# Altium schematic sheet FM375_TEST_BOARD.SchDoc
size A0; PageSetup: Record=PageOptions|CenterHorizontal=True|CenterVertical=True|PrintScale=0.17|XCorrection=1.00|YCorrection=1.00|PrintKind=1|BorderSize=5000000|LeftOffset=0|BottomOffset=0|Orientation=1|PaperLength=1000|PaperWidth=1000|Scale=100|PaperSource=15|PrintQuality=600|MediaType=1|DitherType=10|PaperKind=A4|PrintScaleMode=1
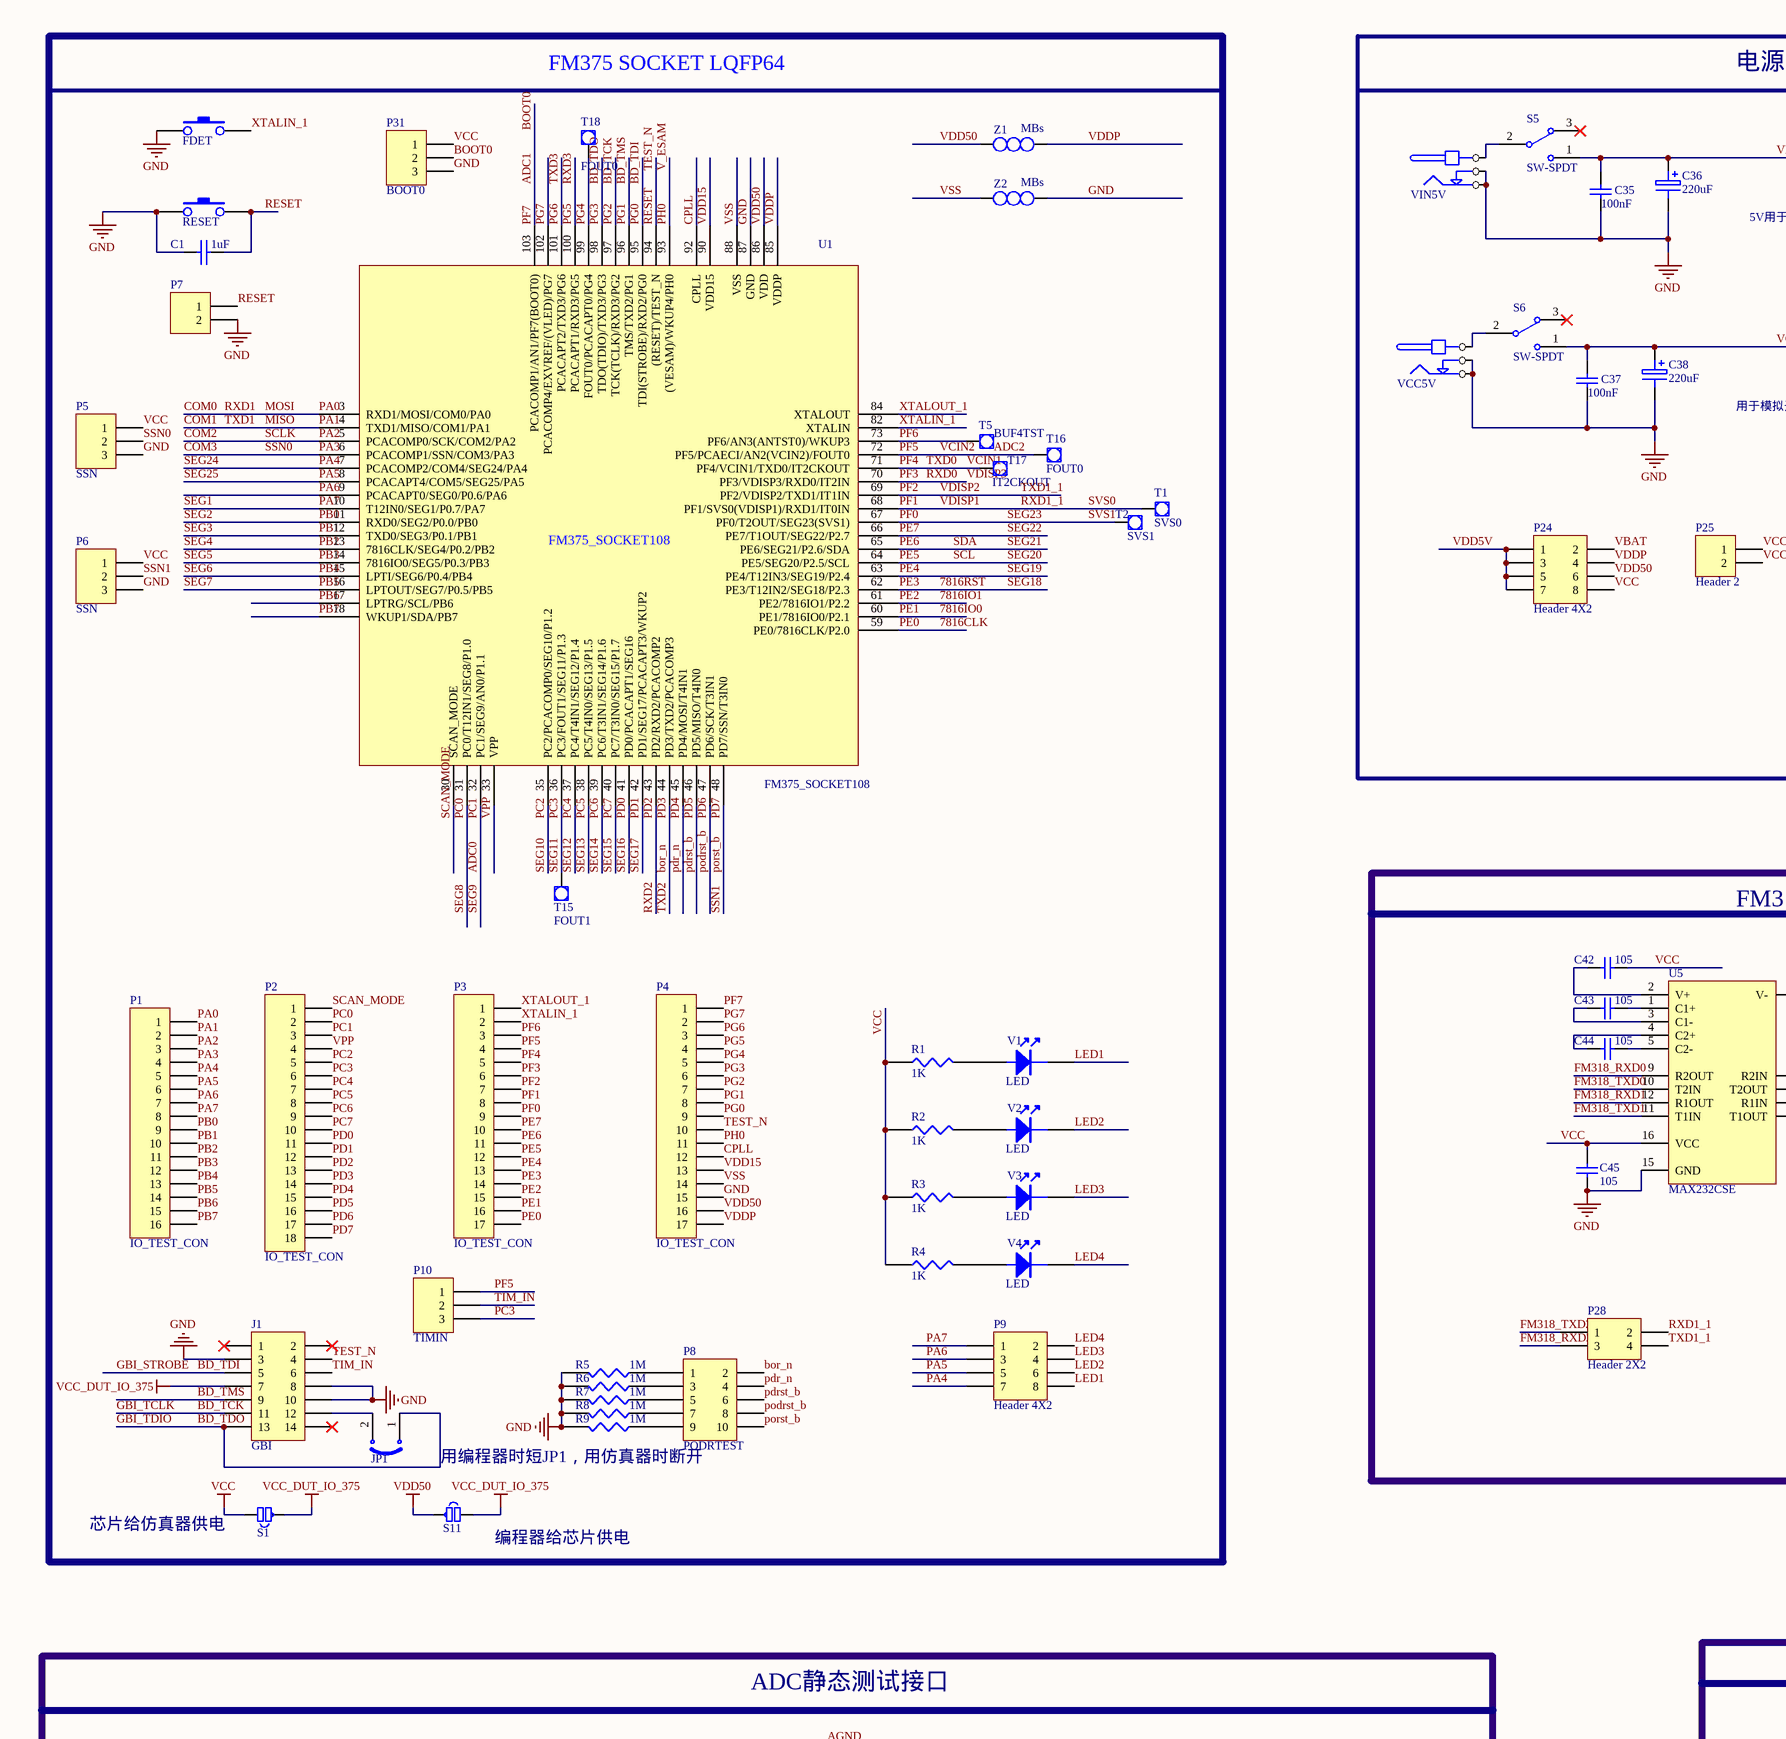
[diagram p0: FM375_TEST_BOARD.SchDoc, top left]
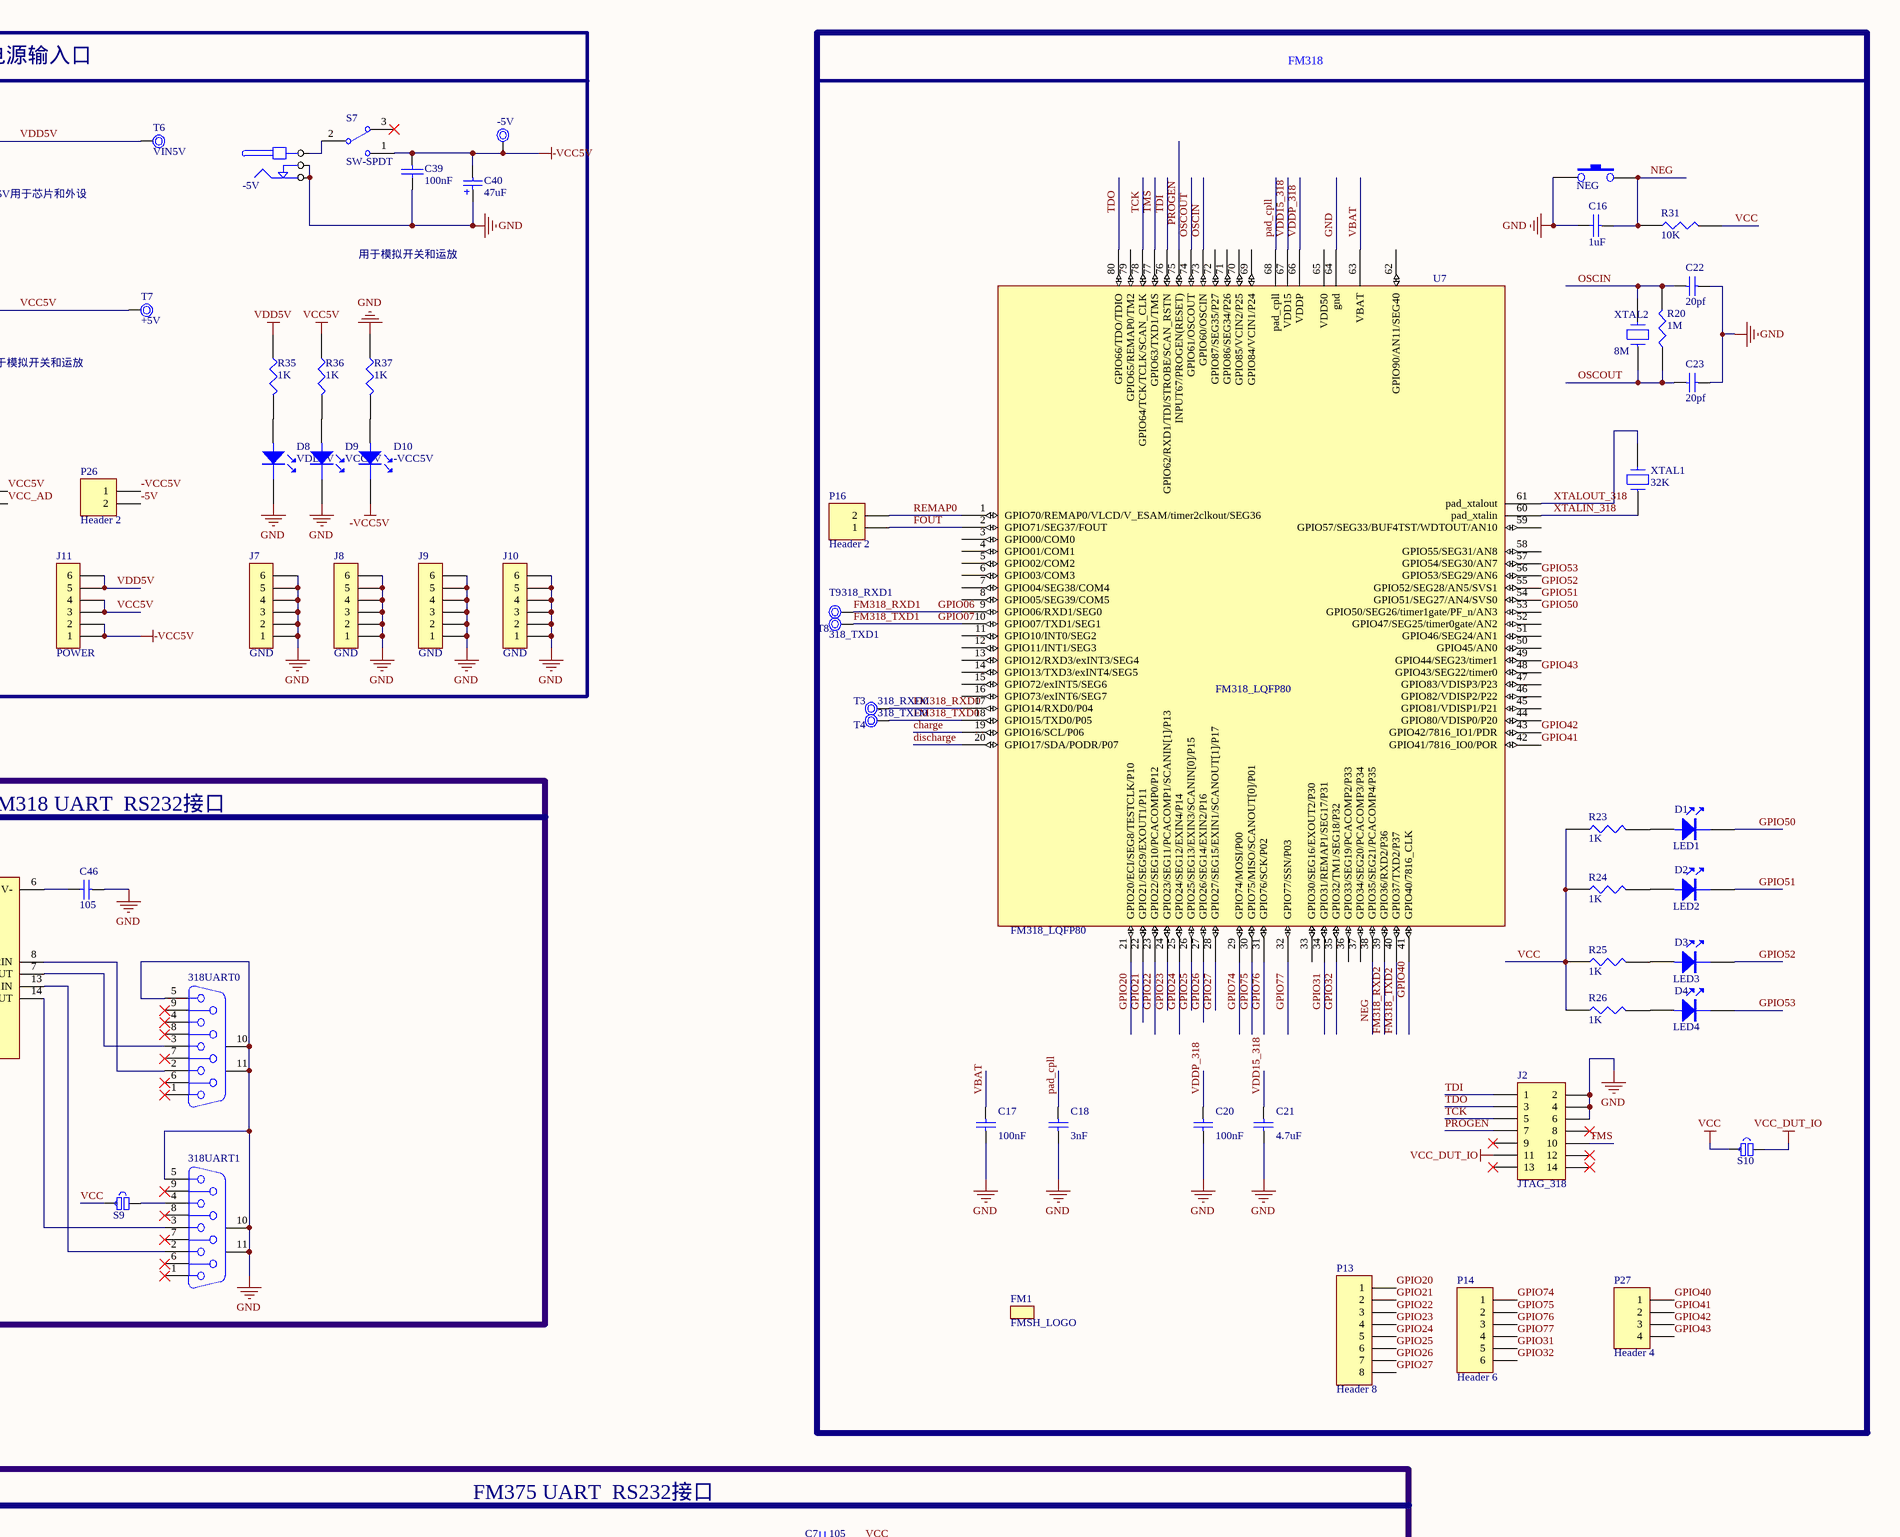
[diagram p1: FM375_TEST_BOARD.SchDoc, top right]
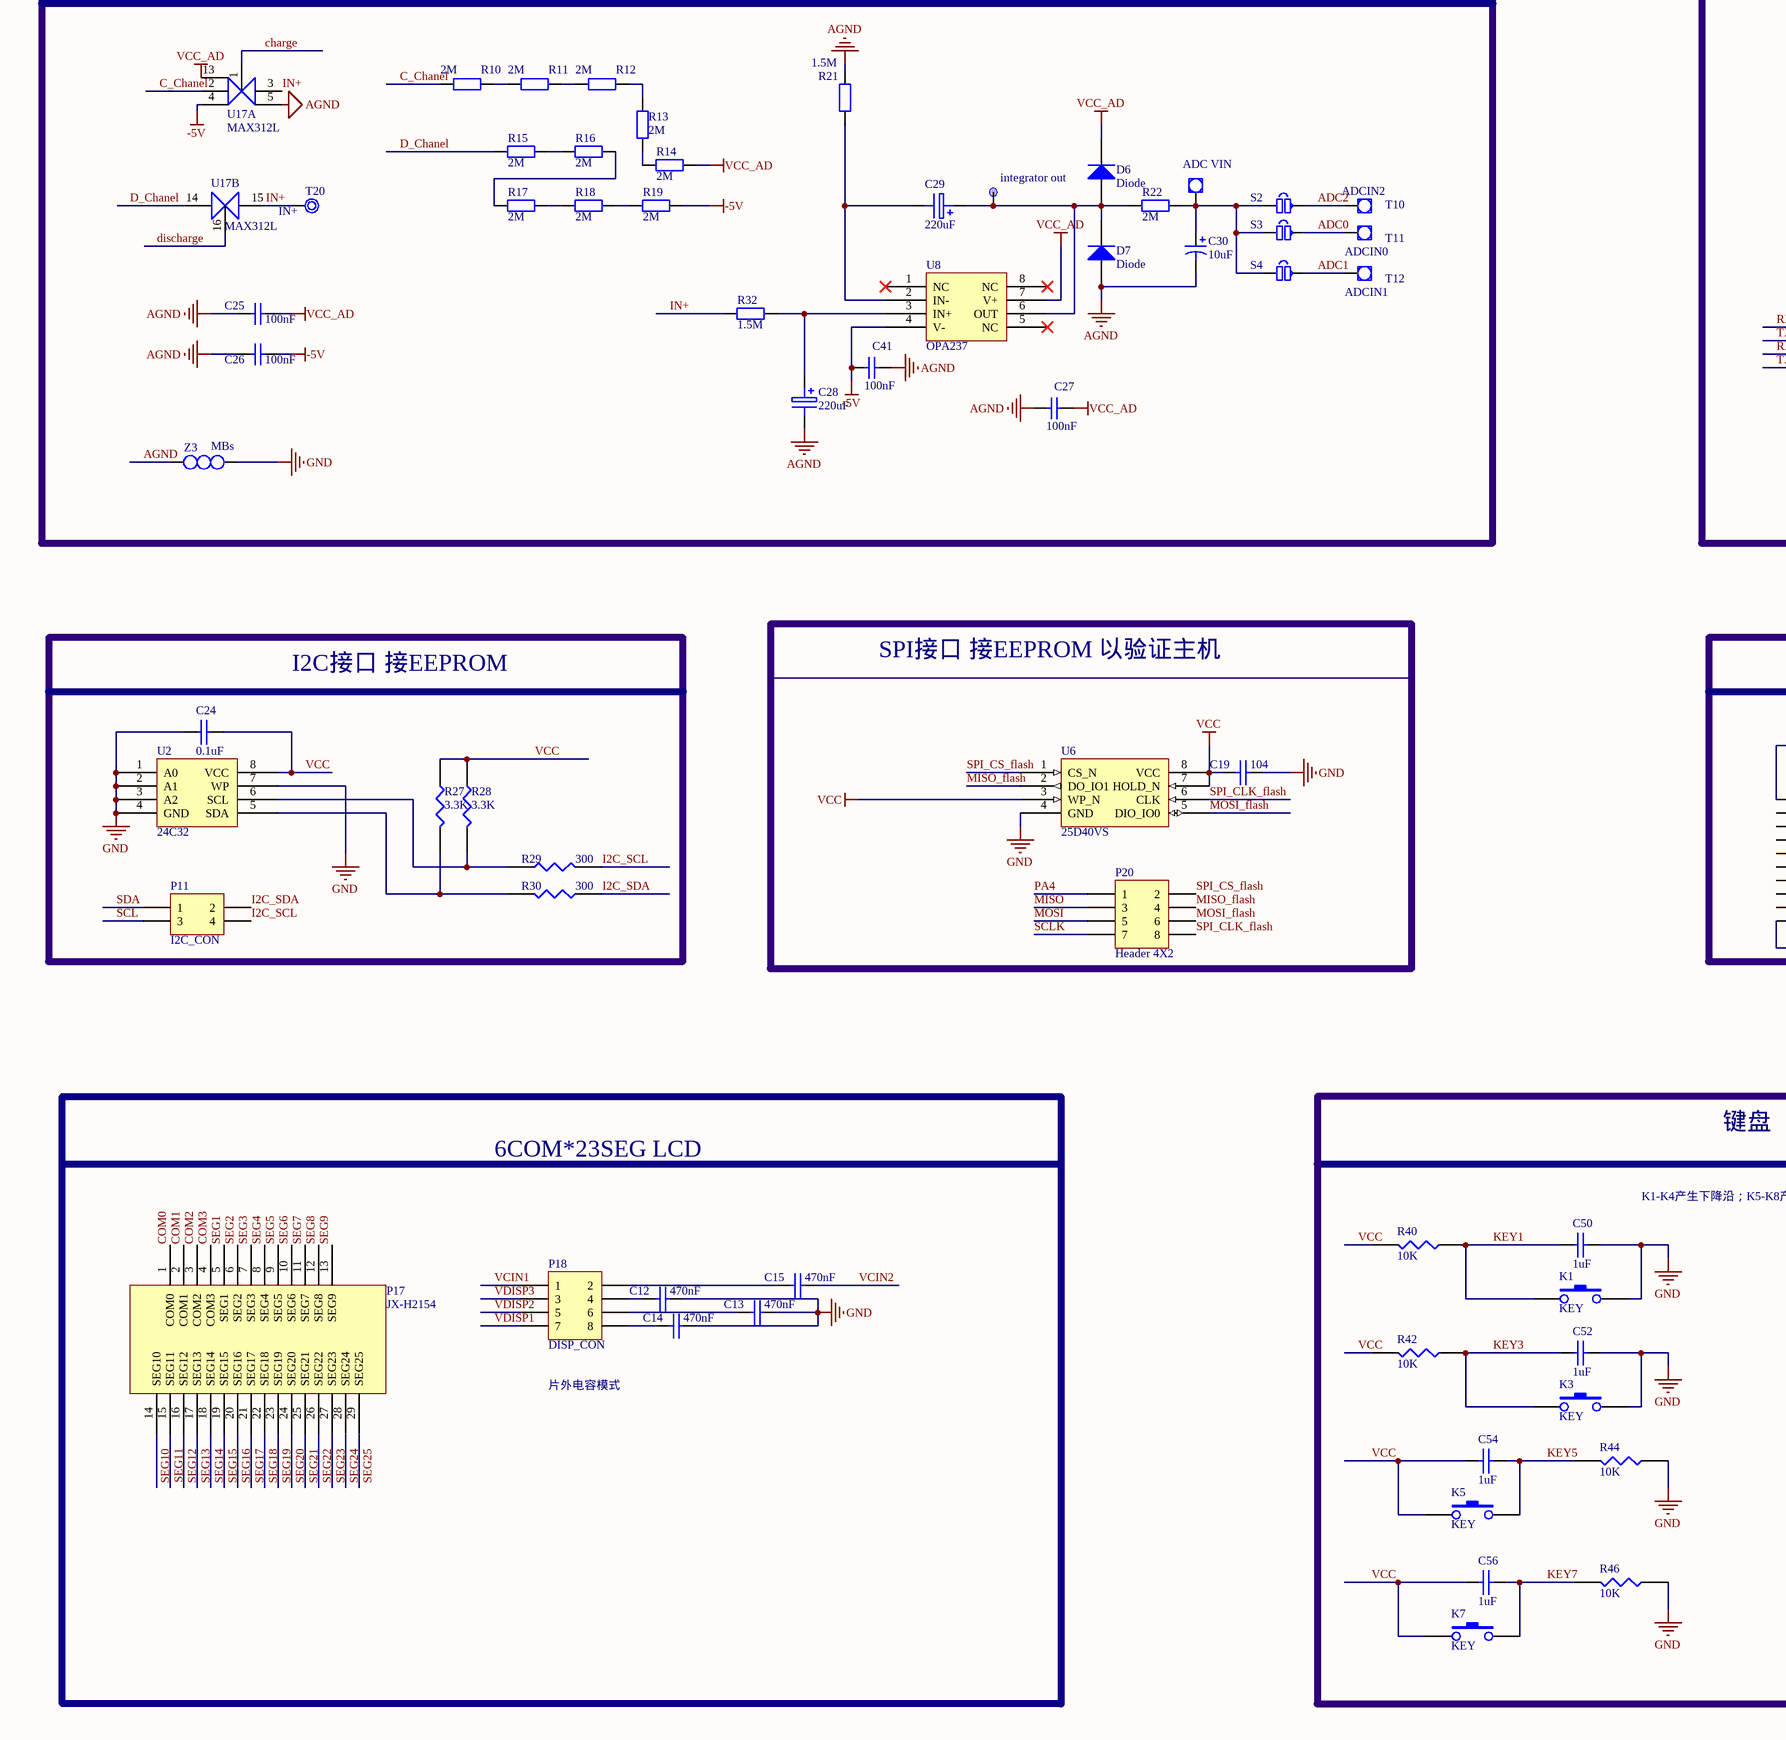
[diagram p2: FM375_TEST_BOARD.SchDoc, bottom left]
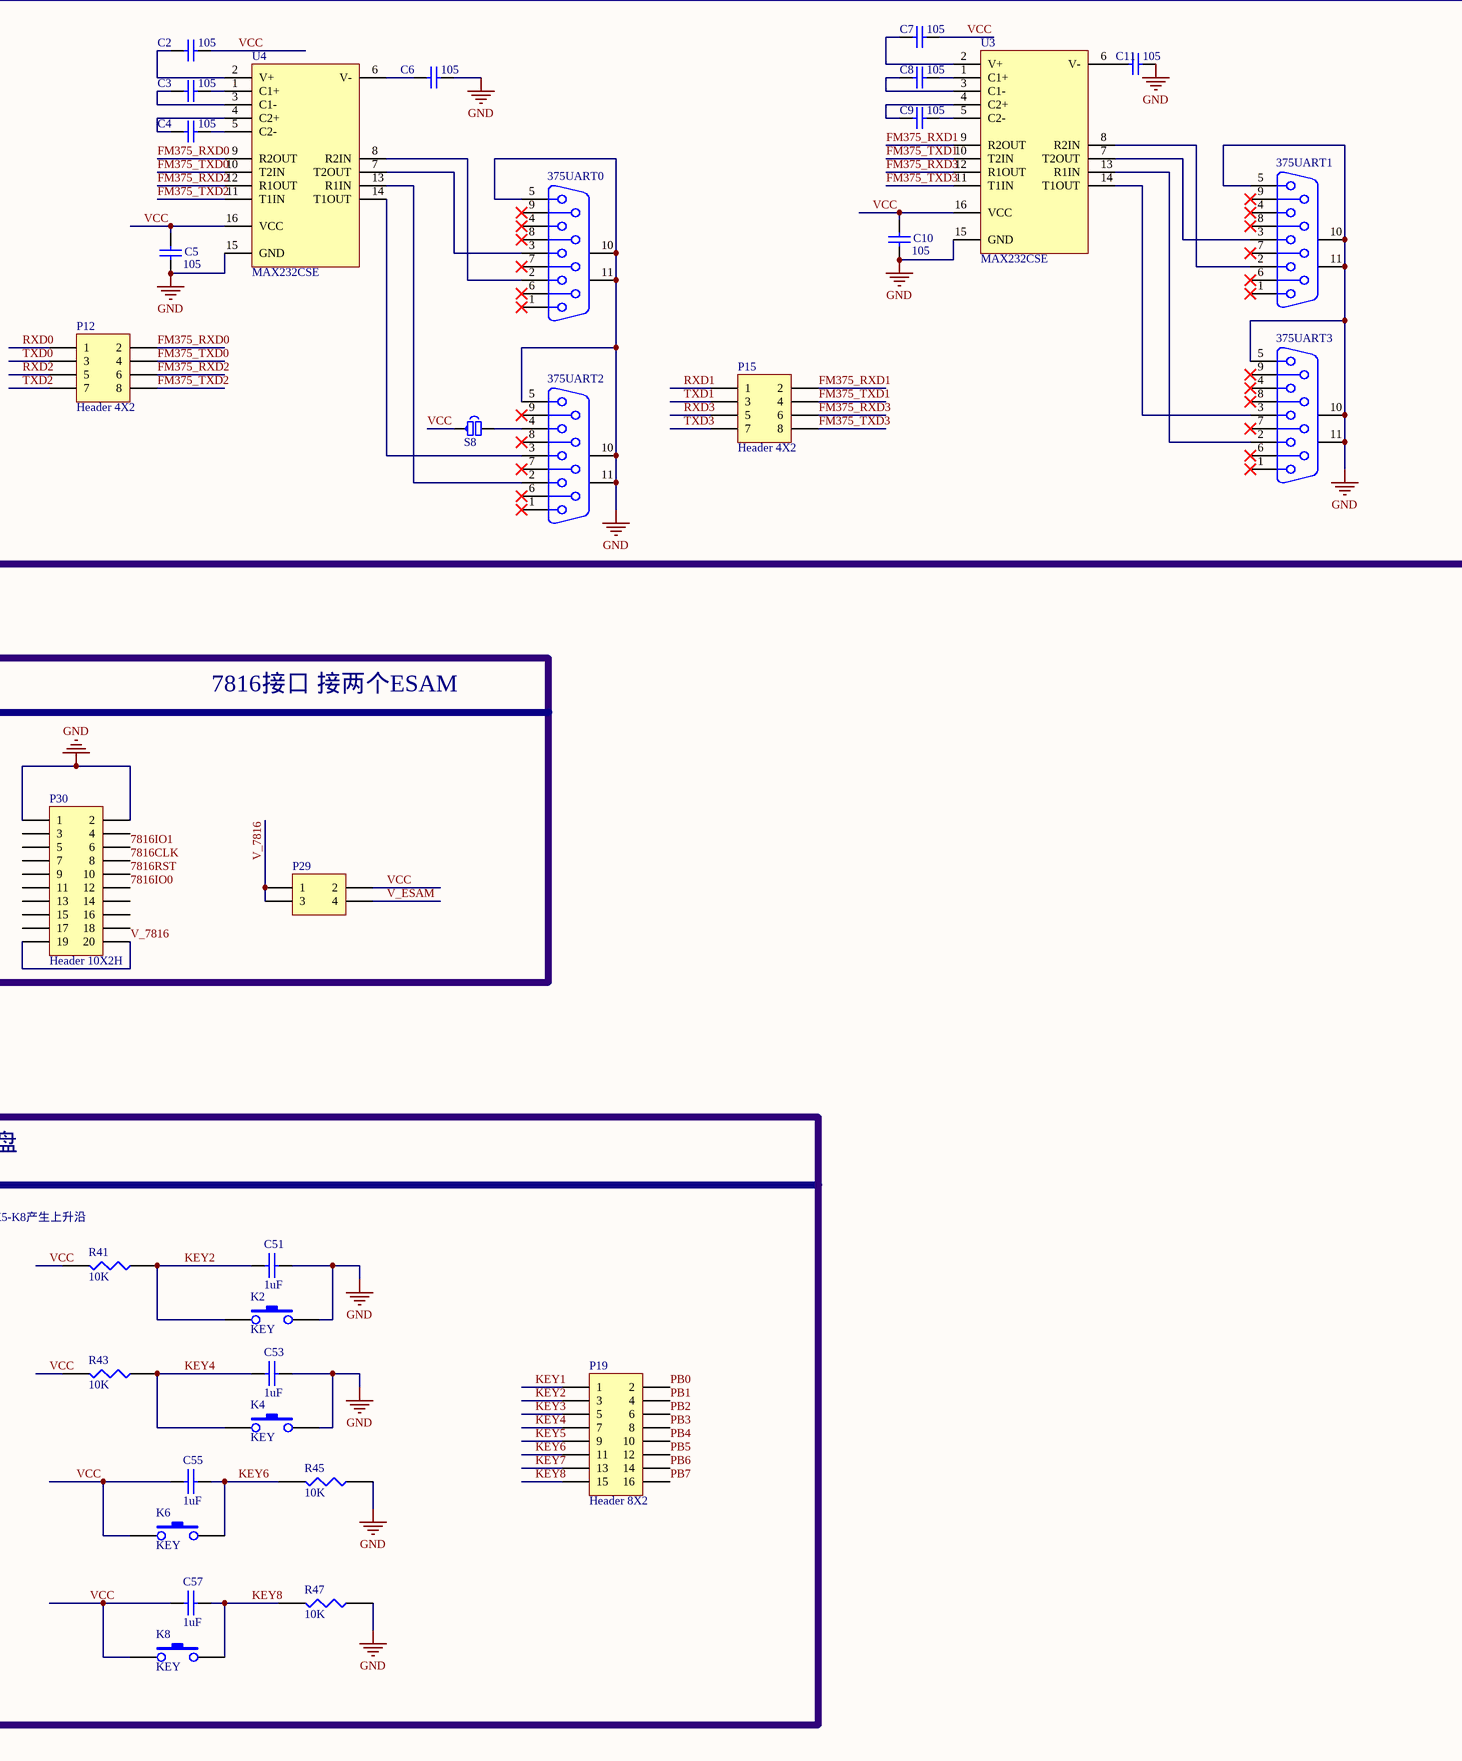
[diagram p3: FM375_TEST_BOARD.SchDoc, bottom right]

## Parts
318UART0  D Connector 9  [DB9RA/M]  (value not drawn)
318UART1  D Connector 9  [DB9RA/M]  (value not drawn)
375UART0  D Connector 9  [DB9RA/M]  (value not drawn)
375UART1  D Connector 9  [DB9RA/M]  (value not drawn)
375UART2  D Connector 9  [DB9RA/M]  (value not drawn)
375UART3  D Connector 9  [DB9RA/M]  (value not drawn)
-5V  -5V  [TEST_PT]  (value not drawn)
ADC_VIN  ADCIN2  [SIP1]  (value not drawn)
C1  1uF  [0805]
C2  105  [0805]
C3  105  [0805]
C4  105  [0805]
C5  105  [0805]
C6  105  [0805]
C7  105  [0805]
C8  105  [0805]
C9  105  [0805]
C10  105  [0805]
C11  105  [0805]
C12  470nF  [0805]
C13  470nF  [0805]
C14  470nF  [0805]
C15  470nF  [0805]
C16  1uF  [0805]
C17  value 100nF  [0805]  (hidden comment: 104)
C18  value 3nF  [0805]  (hidden comment: 104)
C19  104  [0805]
C20  value 100nF  [0805]  (hidden comment: 104)
C21  4.7uf  [0805]
C22  20pf  [0805]
C23  20pf  [0805]
C24  0.1uF  [0805]
C25  100nF  [0805]
C26  100nF  [0805]
C27  100nF  [0805]
C28  220uF  [NSM-EC]
C29  220uF  [NSM-EC]
C30  10uF  [SMD电容_B型_1]
C35  100nF  [0805]
C36  220uF  [NSM-EC]
C37  100nF  [0805]
C38  220uF  [NSM-EC]
C39  100nF  [0805]
C40  47uF  [SMD电容_B型_1]
C41  100nF  [0805]
C42  105  [0805]
C43  105  [0805]
C44  105  [0805]
C45  105  [0805]
C46  105  [0805]
C50  1uF  [0805]
C51  1uF  [0805]
C52  1uF  [0805]
C53  1uF  [0805]
C54  1uF  [0805]
C55  1uF  [0805]
C56  1uF  [0805]
C57  1uF  [0805]
D1  LED1  [LED-DIODE0.1-BIGHOLE]
D2  LED2  [LED-DIODE0.1-BIGHOLE]
D3  LED3  [LED-DIODE0.1-BIGHOLE]
D4  LED4  [LED-DIODE0.1-BIGHOLE]
D6  Diode  [DIODE_M7]
D7  Diode  [DIODE_M7]
D8  VDD5V  [LED-DIODE0.1-BIGHOLE]
D9  VCC5V  [LED-DIODE0.1-BIGHOLE]
D10  -VCC5V  [LED-DIODE0.1-BIGHOLE]
FDET  KEY  [BUTTON-S]  (value not drawn)
FM1  FMSH_LOGO  [FMSH-LOGO-1]
integrator_out  MCO  [TEST_PT]  (value not drawn)
J1  GBI  [HDR7X2-LP]
J2  JTAG_318  [JTAG_BIRD]
J7  GND  [SIP6]
J8  GND  [SIP6]
J9  GND  [SIP6]
J10  GND  [SIP6]
J11  POWER  [SIP6]
JP1  (no value)  [SIP2]
K1  KEY  [BUTTON-S]
K2  KEY  [BUTTON-S]
K3  KEY  [BUTTON-S]
K4  KEY  [BUTTON-S]
K5  KEY  [BUTTON-S]
K6  KEY  [BUTTON-S]
K7  KEY  [BUTTON-S]
K8  KEY  [BUTTON-S]
NEG  KEY  [BUTTON-S]  (value not drawn)
P1  IO_TEST_CON  [HDR1X16]
P2  IO_TEST_CON  [HDR1X18]
P3  IO_TEST_CON  [HDR1X17]
P4  IO_TEST_CON  [HDR1X17]
P5  SSN  [HDR1X3]
P6  SSN  [HDR1X3]
P7  Header 2  [HDR1X2]  (value not drawn)
P8  PODRTEST  [HDR2X5]
P9  Header 4X2  [HDR2X4]
P10  TIMIN  [HDR1X3]
P11  I2C_CON  [HDR2X2]
P12  Header 4X2  [HDR2X4]
P13  Header 8  [HDR1X8]
P14  Header 6  [HDR1X6]
P15  Header 4X2  [HDR2X4]
P16  Header 2  [HDR1X2]
P17  JX-H2154  [JX-H2154]
P18  DISP_CON  [HDR2X4]
P19  Header 8X2  [HDR2X8]
P20  Header 4X2  [HDR2X4]
P21  VIN5V  [POWERJACK]
P22  VCC5V  [POWERJACK]
P23  -5V  [POWERJACK]
P24  Header 4X2  [HDR2X4]
P25  Header 2  [HDR1X2]
P26  Header 2  [HDR1X2]
P27  Header 4  [HDR1X4]
P28  Header 2X2  [HDR2X2]
P29  Header 2X2  [HDR2X2]  (value not drawn)
P30  Header 10X2H  [HDR2X10H]
P31  BOOT0  [HDR1X3]
R1  1K  [0805]
R2  1K  [0805]
R3  1K  [0805]
R4  1K  [0805]
R5  1M  [0805]
R6  1M  [0805]
R7  1M  [0805]
R8  1M  [0805]
R9  1M  [0805]
R10  2M  [0805]
R11  2M  [0805]
R12  2M  [0805]
R13  2M  [0805]
R14  2M  [0805]
R15  2M  [0805]
R16  2M  [0805]
R17  2M  [0805]
R18  2M  [0805]
R19  2M  [0805]
R20  1M  [0805]
R21  1.5M  [0805]
R22  2M  [0805]
R23  1K  [0805]
R24  1K  [0805]
R25  1K  [0805]
R26  1K  [0805]
R27  3.3K  [0805]
R28  3.3K  [0805]
R29  300  [0805]
R30  300  [0805]
R31  10K  [0805]
R32  1.5M  [0805]
R35  1K  [0805]
R36  1K  [0805]
R37  1K  [0805]
R40  10K  [0805]
R41  10K  [0805]
R42  10K  [0805]
R43  10K  [0805]
R44  10K  [0805]
R45  10K  [0805]
R46  10K  [0805]
R47  10K  [0805]
RESET  KEY  [BUTTON-S]  (value not drawn)
S1  SHORT  [0603_SHORT_Y]  (value not drawn)
S2  JUMPER  [0603_SHORT_Y]  (value not drawn)
S3  JUMPER  [0603_SHORT_Y]  (value not drawn)
S4  JUMPER  [0603_SHORT_Y]  (value not drawn)
S5  SW-SPDT  [SW2]
S6  SW-SPDT  [SW2]
S7  SW-SPDT  [SW2]
S8  JUMPER  [0603_SHORT_Y]  (value not drawn)
S9  JUMPER  [0603_SHORT_Y]  (value not drawn)
S10  SHORT  [0603_SHORT_Y]  (value not drawn)
S11  SHORT  [0603_SHORT_Y]  (value not drawn)
T1  SVS0  [TEST_PT]
T2  SVS1  [TEST_PT]
T3  318_RXD0  [TEST_PT]
T4  318_TXD0  [TEST_PT]
T5  BUF4TST  [TEST_PT]
T6  VIN5V  [TEST_PT]
T7  +5V  [TEST_PT]
T8  318_TXD1  [TEST_PT]
T9  318_RXD1  [TEST_PT]
T10  ADCIN2  [TEST_PT]
T11  ADCIN0  [TEST_PT]
T12  ADCIN1  [TEST_PT]
T15  FOUT1  [TEST_PT]
T16  FOUT0  [TEST_PT]
T17  IT2CKOUT  [TEST_PT]
T18  FOUT0  [TEST_PT]
T20  IN+  [TEST_PT]
U1  FM375_SOCKET108  [SOCKET108_LARGE]
U2  24C32  [SOIC8_SOP8]
U3  MAX232CSE  [NSO16_M]
U4  MAX232CSE  [NSO16_M]
U5  MAX232CSE  [NSO16_M]
U6  25D40VS  [SOP8-1.27]
U7  FM318_LQFP80  [LQFP80_12x12]
U8  OPA237  [OPA237_SO8]
U17  MAX312L  [TSSOP16]  (parts A,B of 4)
V1  LED  [LED-DIODE0.1-BIGHOLE]
V2  LED  [LED-DIODE0.1-BIGHOLE]
V3  LED  [LED-DIODE0.1-BIGHOLE]
V4  LED  [LED-DIODE0.1-BIGHOLE]
XTAL1  32K  [XTAL-RB32K_2]
XTAL2  8M  [XTAL-RAD0.2]
Z1  MBs  [0603]
Z2  MBs  [0603]
Z3  MBs  [0603]

## Blocks framed on the sheet
FM375 SOCKET LQFP64: C1 FDET J1 JP1 P1-P10 P31 R1-R9 RESET S1 S11 T1 T2 T5 T15-T18 U1 V1-V4 Z1 Z2
电源输入口: -5V C35-C40 D8-D10 J7-J11 P21-P26 R35-R37 S5-S7 T6 T7
FM318: C16-C18 C20-C23 D1-D4 FM1 J2 NEG P13 P14 P16 P27 R20 R23-R26 R31 S10 T3 T4 T8 T9 U7 XTAL1 XTAL2
FM318 UART  RS232接口: 318UART0 318UART1 C42-C46 P28 S9 U5
ADC静态测试接口: ADC_VIN C25-C30 C41 D6 D7 integrator_out R10-R19 R21 R22 R32 S2-S4 T10-T12 T20 U8 U17 Z3
FM375 UART  RS232接口: 375UART0-375UART3 C2-C11 P12 P15 S8 U3 U4
I2C接口 接EEPROM: C24 P11 R27-R30 U2
SPI接口 接EEPROM 以验证主机: C19 P20 U6
7816接口 接两个ESAM: P29 P30
6COM*23SEG LCD: C12-C15 P17 P18
键盘: C50-C57 K1-K8 P19 R40-R47

## Nets
-5V: C26.2 C41.1 P26.2 R19.2 U8.4(V-) U17.4(V-)
-VCC5V: -5V.1 C39.1 C40.2 D10.K J11.1 J11.2 P26.1 S7.1
AGND: C25.1 C26.1 C27.1 C28.2 C30.2 C41.2 D7.1(A) R21.2 U17.5(GND) Z3.1
GND: 318UART0.5 318UART0.10(MH1) 318UART0.11(MH2) 318UART1.5 318UART1.10(MH1) 318UART1.11(MH2) 375UART0.5 375UART0.10(MH1) 375UART0.11(MH2) 375UART1.5 375UART1.10(MH1) 375UART1.11(MH2) 375UART2.5 375UART2.10(MH1) 375UART2.11(MH2) 375UART3.5 375UART3.10(MH1) 375UART3.11(MH2) C1.2 C5.1 C6.2 C10.1 C11.2 C12.2 C13.2 C14.2 C16.2 C17.1 C18.1 C19.1 C20.1 C21.1 C22.2 C23.2 C24.1 C35.2 C36.2 C37.2 C38.2 C39.2 C40.1 C45.1 C46.1 C50.2 C51.2 C52.2 C53.2 D8.K D9.K FDET.1 J1.3 J1.8 J1.10 J2.2 J2.4 J2.6 J7.1 J7.2 J7.3 J7.4 J7.5 J7.6 J8.1 J8.2 J8.3 J8.4 J8.5 J8.6 J9.1 J9.2 J9.3 J9.4 J9.5 J9.6 J10.1 J10.2 J10.3 J10.4 J10.5 J10.6 K1.2 K2.2 K3.2 K4.2 NEG.1 P4.15 P5.3 P6.3 P7.2 P21.2 P21.3 P22.2 P22.3 P23.2 P23.3 P30.1 P30.2 P31.3 R5.2 R6.2 R7.2 R8.2 R9.2 R37.1 R44.1 R45.1 R46.1 R47.1 RESET.1 U1.87(GND) U2.1(A0) U2.2(A1) U2.3(A2) U2.4(GND) U2.7(WP) U3.15(GND) U4.15(GND) U5.15(GND) U6.4(GND) U7.64(gnd) Z2.2 Z3.2
VCC: C2.2 C5.2 C7.2 C10.2 C19.2 C24.2 C42.2 C45.2 C54.1 C55.1 C56.1 C57.1 K5.1 K6.1 K7.1 K8.1 P5.1 P6.1 P24.8 P29.2 P31.1 R1.1 R2.1 R3.1 R4.1 R23.1 R24.1 R25.1 R26.1 R27.1 R28.1 R31.2 R40.2 R41.2 R42.2 R43.2 S1.2 S8.1 S9.1 S10.1 U2.8(VCC) U3.16(VCC) U4.16(VCC) U5.16(VCC) U6.3(WP_N) U6.7(HOLD_N) U6.8(VCC)
VCC5V: C37.1 C38.1 J11.3 J11.4 P25.1 R36.1 S6.1 T7.1
VCC_AD: C25.2 C27.2 D6.2(K) P25.2 R14.2 U8.7(V+) U17.13(V+)
VCC_DUT_IO: J2.11 S10.2
VCC_DUT_IO_375: J1.7 S1.1 S11.2
VDD5V: C35.1 C36.1 J11.5 J11.6 P24.1 P24.3 P24.5 P24.7 R35.1 S5.1 T6.1
VDD50: P4.16 P24.6 S11.1 U1.86(VDD) Z1.1
7816CLK: P3.17 P30.8 U1.59(PE0/7816CLK/P2.0)  [also labelled PE0]
7816IO0: P3.16 P30.12 U1.60(PE1/7816IO0/P2.1)  [also labelled PE1]
7816IO1: P3.15 P30.6 U1.61(PE2/7816IO1/P2.2)  [also labelled PE2]
7816RST: P3.14 P17.22(SEG18) P30.10 U1.62(PE3/T12IN2/SEG18/P2.3)  [also labelled PE3, SEG18]
ADC0: P2.3 P17.13(SEG9) S3.1 T11.1 U1.32(PC1/SEG9/AN0/P1.1)  [also labelled PC1, SEG9]
ADC1: P4.1 P31.2 S4.1 T12.1 U1.103(PCACOMP1/AN1/PF7(BOOT0))  [also labelled BOOT0, PF7]
ADC2: C15.2 P3.4 P10.1 S2.1 T10.1 T16.1 U1.72(PF5/PCAECI/AN2(VCIN2)/FOUT0)  [also labelled PF5, VCIN2]
BD_TCK: J1.11 P4.7 U1.97(TCK(TCLK)/RXD3/PG2)  [also labelled GBI_TCLK, PG2]
BD_TDI: J1.5 P4.9 U1.95(TDI(STROBE)/RXD2/PG0)  [also labelled GBI_STROBE, PG0]
BD_TDO: J1.13 JP1.1 P4.6 U1.98(TDO(TDIO)/TXD3/PG3)  [also labelled GBI_TDIO, PG3]
BD_TMS: J1.9 P4.8 U1.96(TMS/TXD2/PG1)  [also labelled PG1]
bor_n: P2.14 P8.2 P12.7 U1.44(PD3/TXD2/PCACOMP3)  [also labelled PD3, TXD2]
C_Chanel: R10.2 U17.2(COM1)
charge: U7.19(GPIO16/SCL/P06) U17.1(IN1)
COM0: P1.1 P15.1 P17.1(COM0) P20.5 U1.3(RXD1/MOSI/COM0/PA0)  [also labelled MOSI, PA0, RXD1]
COM1: P1.2 P15.3 P17.2(COM1) P20.3 U1.4(TXD1/MISO/COM1/PA1)  [also labelled MISO, PA1, TXD1]
COM2: P1.3 P17.3(COM2) P20.7 U1.5(PCACOMP0/SCK/COM2/PA2)  [also labelled PA2, SCLK]
COM3: P1.4 P5.2 P17.4(COM3) U1.6(PCACOMP1/SSN/COM3/PA3)  [also labelled PA3, SSN0]
CPLL: P4.12 U1.92(CPLL)
D_Chanel: R15.1 U17.14(NO2)
discharge: U7.20(GPIO17/SDA/PODR/P07) U17.16(IN2)
FM318_RXD0: T3.1 U5.9(R2OUT) U7.17(GPIO14/RXD0/P04)
FM318_RXD1: T9.1 U5.12(R1OUT) U7.9(GPIO06/RXD1/SEG0)  [also labelled GPIO06]
FM318_RXD2: P28.3 U7.39(GPIO36/RXD2/P36)
FM318_TXD0: T4.1 U5.10(T2IN) U7.18(GPIO15/TXD0/P05)
FM318_TXD1: T8.1 U5.11(T1IN) U7.10(GPIO07/TXD1/SEG1)  [also labelled GPIO07]
FM318_TXD2: P28.1 U7.40(GPIO37/TXD2/P37)
FM375_RXD0: P12.2 U4.9(R2OUT)
FM375_RXD1: P15.2 U3.9(R2OUT)
FM375_RXD2: P12.6 U4.12(R1OUT)
FM375_RXD3: P15.6 U3.12(R1OUT)
FM375_TXD0: P12.4 U4.10(T2IN)
FM375_TXD1: P15.4 U3.10(T2IN)
FM375_TXD2: P12.8 U4.11(T1IN)
FM375_TXD3: P15.8 U3.11(T1IN)
FOUT: P16.1 U7.2(GPIO71/SEG37/FOUT)
GPIO20: P13.1 U7.21(GPIO20/ECI/SEG8/TESTCLK/P10)
GPIO21: P13.2 U7.22(GPIO21/SEG9/EXOUT1/P11)
GPIO22: P13.3 U7.23(GPIO22/SEG10/PCACOMP0/P12)
GPIO23: P13.4 U7.24(GPIO23/SEG11/PCACOMP1/SCANIN[1]/P13)
GPIO24: P13.5 U7.25(GPIO24/SEG12/EXIN4/P14)
GPIO25: P13.6 U7.26(GPIO25/SEG13/EXIN3/SCANIN[0]/P15)
GPIO26: P13.7 U7.27(GPIO26/SEG14/EXIN2/P16)
GPIO27: P13.8 U7.28(GPIO27/SEG15/EXIN1/SCANOUT[1]/P17)
GPIO31: P14.5 U7.34(GPIO31/REMAP1/SEG17/P31)
GPIO32: P14.6 U7.35(GPIO32/TM1/SEG18/P32)
GPIO40: P27.1 U7.41(GPIO40/7816_CLK)
GPIO41: P27.2 U7.42(GPIO41/7816_IO0/POR)
GPIO42: P27.3 U7.43(GPIO42/7816_IO1/PDR)
GPIO43: P27.4 U7.48(GPIO43/SEG22/timer0)
GPIO50: D1.K U7.53(GPIO50/SEG26/timer1gate/PF_n/AN3)
GPIO51: D2.K U7.54(GPIO51/SEG27/AN4/SVS0)
GPIO52: D3.K U7.55(GPIO52/SEG28/AN5/SVS1)
GPIO53: D4.K U7.56(GPIO53/SEG29/AN6)
GPIO74: P14.1 U7.29(GPIO74/MOSI/P00)
GPIO75: P14.2 U7.30(GPIO75/MISO/SCANOUT[0]/P01)
GPIO76: P14.3 U7.31(GPIO76/SCK/P02)
GPIO77: P14.4 U7.32(GPIO77/SSN/P03)
I2C_SCL: P11.4 R29.2
I2C_SDA: P11.2 R30.1
IN+: R32.2 T20.1 U17.3(NO1) U17.15(COM2)
KEY1: C50.1 K1.1 P19.1 R40.1
KEY2: C51.1 K2.1 P19.3 R41.1
KEY3: C52.1 K3.1 P19.5 R42.1
KEY4: C53.1 K4.1 P19.7 R43.1
KEY5: C54.2 K5.2 P19.9 R44.2
KEY6: C55.2 K6.2 P19.11 R45.2
KEY7: C56.2 K7.2 P19.13 R46.2
KEY8: C57.2 K8.2 P19.15 R47.2
LED1: P9.8 V1.K
LED2: P9.6 V2.K
LED3: P9.4 V3.K
LED4: P9.2 V4.K
MISO_flash: P20.4 U6.2(DO_IO1)
MOSI_flash: P20.6 U6.5(DIO_IO0)
NEG: C16.1 NEG.2 R31.1 U7.38(GPIO35/SEG21/PCACOMP4/P35)
OSCIN: C22.1 R20.2 U7.73(GPIO60/OSCIN) XTAL2.2
OSCOUT: C23.1 R20.1 U7.74(GPIO61/OSCOUT) XTAL2.1
PA4: P1.5 P9.7 P17.28(SEG24) P20.1 U1.7(PCACOMP2/COM4/SEG24/PA4)  [also labelled SEG24]
PA5: P1.6 P9.5 P17.29(SEG25) U1.8(PCACAPT4/COM5/SEG25/PA5)  [also labelled SEG25]
PA6: P1.7 P9.3 U1.9(PCACAPT0/SEG0/P0.6/PA6)
PA7: P1.8 P9.1 P17.5(SEG1) U1.10(T12IN0/SEG1/P0.7/PA7)  [also labelled SEG1]
pad_cpll: C18.2 U7.68(pad_cpll)
PB0: P1.9 P17.6(SEG2) P19.2 U1.11(RXD0/SEG2/P0.0/PB0)  [also labelled SEG2]
PB1: P1.10 P17.7(SEG3) P19.4 U1.12(TXD0/SEG3/P0.1/PB1)  [also labelled SEG3]
PB2: P1.11 P17.8(SEG4) P19.6 U1.13(7816CLK/SEG4/P0.2/PB2)  [also labelled SEG4]
PB3: P1.12 P17.9(SEG5) P19.8 U1.14(7816IO0/SEG5/P0.3/PB3)  [also labelled SEG5]
PB4: P1.13 P17.10(SEG6) P19.10 U1.15(LPTI/SEG6/P0.4/PB4)  [also labelled SEG6]
PB5: P1.14 P17.11(SEG7) P19.12 U1.16(LPTOUT/SEG7/P0.5/PB5)  [also labelled SEG7]
PB6: P1.15 P19.14 U1.17(LPTRG/SCL/PB6)
PB7: P1.16 P19.16 U1.18(WKUP1/SDA/PB7)
PC0: P2.2 P17.12(SEG8) U1.31(PC0/T12IN1/SEG8/P1.0)  [also labelled SEG8]
PC2: P2.5 P17.14(SEG10) U1.35(PC2/PCACOMP0/SEG10/P1.2)  [also labelled SEG10]
PC3: P2.6 P10.3 P17.15(SEG11) T15.1 U1.36(PC3/FOUT1/SEG11/P1.3)  [also labelled SEG11]
PC4: P2.7 P17.16(SEG12) U1.37(PC4/T4IN1/SEG12/P1.4)  [also labelled SEG12]
PC5: P2.8 P17.17(SEG13) U1.38(PC5/T4IN0/SEG13/P1.5)  [also labelled SEG13]
PC6: P2.9 P17.18(SEG14) U1.39(PC6/T3IN1/SEG14/P1.6)  [also labelled SEG14]
PC7: P2.10 P17.19(SEG15) U1.40(PC7/T3IN0/SEG15/P1.7)  [also labelled SEG15]
PD0: P2.11 P17.20(SEG16) U1.41(PD0/PCACAPT1/SEG16)  [also labelled SEG16]
PD1: P2.12 P17.21(SEG17) U1.42(PD1/SEG17/PCACAPT3/WKUP2)  [also labelled SEG17]
PD2: P2.13 P12.5 U1.43(PD2/RXD2/PCACOMP2)  [also labelled RXD2]
PD4: P2.15 P8.4 U1.45(PD4/MOSI/T4IN1)  [also labelled pdr_n]
PD5: P2.16 P8.6 U1.46(PD5/MISO/T4IN0)  [also labelled pdrst_b]
PD6: P2.17 P8.8 U1.47(PD6/SCK/T3IN1)  [also labelled podrst_b]
PD7: P2.18 P6.2 P8.10 U1.48(PD7/SSN/T3IN0)  [also labelled porst_b, SSN1]
PE4: P3.13 P17.23(SEG19) U1.63(PE4/T12IN3/SEG19/P2.4)  [also labelled SEG19]
PE5: P3.12 P11.3 P17.24(SEG20) U1.64(PE5/SEG20/P2.5/SCL)  [also labelled SCL, SEG20]
PE6: P3.11 P11.1 P17.25(SEG21) U1.65(PE6/SEG21/P2.6/SDA)  [also labelled SDA, SEG21]
PE7: P3.10 P17.26(SEG22) U1.66(PE7/T1OUT/SEG22/P2.7)  [also labelled SEG22]
PF0: P3.9 P17.27(SEG23) T2.1 U1.67(PF0/T2OUT/SEG23(SVS1))  [also labelled SEG23, SVS1]
PF1: P3.8 P18.7 P28.2 T1.1 U1.68(PF1/SVS0(VDISP1)/RXD1/IT0IN)  [also labelled RXD1_1, SVS0, VDISP1]
PF2: P3.7 P18.5 P28.4 U1.69(PF2/VDISP2/TXD1/IT1IN)  [also labelled TXD1_1, VDISP2]
PF3: P3.6 P12.1 P18.3 U1.70(PF3/VDISP3/RXD0/IT2IN)  [also labelled RXD0, VDISP3]
PF4: P3.5 P12.3 P18.1 T17.1 U1.71(PF4/VCIN1/TXD0/IT2CKOUT)  [also labelled TXD0, VCIN1]
PF6: P3.3 T5.1 U1.73(PF6/AN3(ANTST0)/WKUP3)
PG4: P4.5 T18.1 U1.99(FOUT0/PCACAPT0/PG4)
PG5: P4.4 P15.5 U1.100(PCACAPT1/RXD3/PG5)  [also labelled RXD3]
PG6: P4.3 P15.7 U1.101(PCACAPT2/TXD3/PG6)  [also labelled TXD3]
PG7: P4.2 U1.102(PCACOMP4/EXVREF/(VLED)/PG7)
PH0: P4.11 P29.4 U1.93((VESAM)/WKUP4/PH0)  [also labelled V_ESAM]
PROGEN: J2.7 U7.75(INPUT67/PROGEN(RESET))
REMAP0: P16.2 U7.1(GPIO70/REMAP0/VLCD/V_ESAM/timer2clkout/SEG36)
RESET: C1.1 J1.4 P4.10 P7.1 RESET.2 U1.94((RESET)/TEST_N)  [also labelled TEST_N]
SCAN_MODE: P2.1 U1.30(SCAN_MODE)
SPI_CLK_flash: P20.8 U6.6(CLK)
SPI_CS_flash: P20.2 U6.1(CS_N)
TCK: J2.5 U7.78(GPIO64/TCK/TCLK/SCAN_CLK)
TDI: J2.1 U7.76(GPIO62/RXD1/TDI/STROBE/SCAN_RSTN)
TDO: J2.3 U7.80(GPIO66/TDO/TDIO)
TIM_IN: J1.6 P10.2
TMS: J2.10 U7.77(GPIO63/TXD1/TMS)
V_7816: P29.1 P29.3 P30.19 P30.20
VBAT: C17.2 P24.2 U7.63(VBAT)
VDD15: P4.13 U1.90(VDD15)
VDD15_318: C21.2 U7.67(VDD15)
VDDP: P4.17 P24.4 U1.85(VDDP) Z1.2
VDDP_318: C20.2 U7.66(VDDP)
VPP: P2.4 U1.33(VPP)
VSS: P4.14 U1.88(VSS) Z2.1
XTALIN_1: FDET.2 P3.2 U1.82(XTALIN)
XTALIN_318: U7.60(pad_xtalin) XTAL1.1
XTALOUT_1: P3.1 U1.84(XTALOUT)
XTALOUT_318: U7.61(pad_xtalout) XTAL1.2
Net318UART0_2: 318UART0.2 U5.8(R2IN)
Net318UART0_3: 318UART0.3 U5.7(T2OUT)
Net318UART1_2: 318UART1.2 U5.13(R1IN)
Net318UART1_3: 318UART1.3 U5.14(T1OUT)
Net318UART1_4: 318UART1.4 S9.2
Net375UART0_2: 375UART0.2 U4.8(R2IN)
Net375UART0_3: 375UART0.3 U4.7(T2OUT)
Net375UART1_2: 375UART1.2 U3.8(R2IN)
Net375UART1_3: 375UART1.3 U3.7(T2OUT)
Net375UART2_2: 375UART2.2 U4.13(R1IN)
Net375UART2_3: 375UART2.3 U4.14(T1OUT)
Net375UART2_4: 375UART2.4 S8.2
Net375UART3_2: 375UART3.2 U3.13(R1IN)
Net375UART3_3: 375UART3.3 U3.14(T1OUT)
NetADC_VIN_1: ADC_VIN.1 C30.1 R22.1 S2.2 S3.2 S4.2
NetC2_1: C2.1 U4.2(V+)
NetC3_1: C3.1 U4.3(C1-)
NetC3_2: C3.2 U4.1(C1+)
NetC4_1: C4.1 U4.4(C2+)
NetC4_2: C4.2 U4.5(C2-)
NetC6_1: C6.1 U4.6(V-)
NetC7_1: C7.1 U3.2(V+)
NetC8_1: C8.1 U3.3(C1-)
NetC8_2: C8.2 U3.1(C1+)
NetC9_1: C9.1 U3.4(C2+)
NetC9_2: C9.2 U3.5(C2-)
NetC11_1: C11.1 U3.6(V-)
NetC12_1: C12.1 P18.4
NetC13_1: C13.1 P18.6
NetC14_1: C14.1 P18.8
NetC15_1: C15.1 P18.2
NetC28_1: C28.1 R32.1 U8.3(IN+)
NetC29_1: C29.1 D6.1(A) D7.2(K) integrator_out.1 R22.2 U8.6(OUT)
NetC29_2: C29.2 R21.1 U8.2(IN-)
NetC42_1: C42.1 U5.2(V+)
NetC43_1: C43.1 U5.3(C1-)
NetC43_2: C43.2 U5.1(C1+)
NetC44_1: C44.1 U5.4(C2+)
NetC44_2: C44.2 U5.5(C2-)
NetC46_2: C46.2 U5.6(V-)
NetD1_A: D1.A R23.2
NetD2_A: D2.A R24.2
NetD3_A: D3.A R25.2
NetD4_A: D4.A R26.2
NetD8_A: D8.A R35.2
NetD9_A: D9.A R36.2
NetD10_A: D10.A R37.2
NetJ1_12: J1.12 JP1.2
NetP8_1: P8.1 R5.1
NetP8_3: P8.3 R6.1
NetP8_5: P8.5 R7.1
NetP8_7: P8.7 R8.1
NetP8_9: P8.9 R9.1
NetP21_1: P21.1 S5.2
NetP22_1: P22.1 S6.2
NetP23_1: P23.1 S7.2
NetR1_2: R1.2 V1.A
NetR2_2: R2.2 V2.A
NetR3_2: R3.2 V3.A
NetR4_2: R4.2 V4.A
NetR10_1: R10.1 R11.2
NetR11_1: R11.1 R12.2
NetR12_1: R12.1 R13.1
NetR13_2: R13.2 R14.1
NetR15_2: R15.2 R16.1
NetR16_2: R16.2 R17.1
NetR17_2: R17.2 R18.1
NetR18_2: R18.2 R19.1
NetR27_2: R27.2 R30.2 U2.5(SDA)
NetR28_2: R28.2 R29.1 U2.6(SCL)

Not connected (* = marked no-connect by the designer): 318UART0 1* 4* 6* 7* 8* 9*; 318UART1 1* 6* 7* 8* 9*; 375UART0 1* 4* 6* 7* 8* 9*; 375UART1 1* 4* 6* 7* 8* 9*; 375UART2 1* 6* 7* 8* 9*; 375UART3 1* 4* 6* 7* 8* 9*; J1 1* 2* 14*; J2 8* 9* 12* 13* 14*; P30 3 4 5 7 9 11 13 14 15 16 17 18; S5 3*; S6 3*; S7 3*; U7 3(GPIO00/COM0) 4(GPIO01/COM1) 5(GPIO02/COM2) 6(GPIO03/COM3) 7(GPIO04/SEG38/COM4) 8(GPIO05/SEG39/COM5) 11(GPIO10/INT0/SEG2) 12(GPIO11/INT1/SEG3) 13(GPIO12/RXD3/exINT3/SEG4) 14(GPIO13/TXD3/exINT4/SEG5) 15(GPIO72/exINT5/SEG6) 16(GPIO73/exINT6/SEG7) 33(GPIO30/SEG16/EXOUT2/P30) 36(GPIO33/SEG19/PCACOMP2/P33) 37(GPIO34/SEG20/PCACOMP3/P34) 44(GPIO80/VDISP0/P20) 45(GPIO81/VDISP1/P21) 46(GPIO82/VDISP2/P22) 47(GPIO83/VDISP3/P23) 49(GPIO44/SEG23/timer1) 50(GPIO45/AN0) 51(GPIO46/SEG24/AN1) 52(GPIO47/SEG25/timer0gate/AN2) 57(GPIO54/SEG30/AN7) 58(GPIO55/SEG31/AN8) 59(GPIO57/SEG33/BUF4TST/WDTOUT/AN10) 62(GPIO90/AN11/SEG40) 65(VDD50) 69(GPIO84/VCIN1/P24) 70(GPIO85/VCIN2/P25) 71(GPIO86/SEG34/P26) 72(GPIO87/SEG35/P27) 79(GPIO65/REMAP0/TM2); U8 1(NC)* 5(NC)* 8(NC)*

## Notes on the sheet
- 5V用于芯片和外设
- 用于模拟开关和运放
- 用编程器时短JP1，用仿真器时断开
- 芯片给仿真器供电
- (near S11) 编程器给芯片供电
- K1-K4产生下降沿；K5-K8产生上升沿
- 片外电容模式

## Library data of the parts
318UART0 318UART1 375UART0-375UART3 = D Connector 9: Receptacle Assembly, 9 Position, Right Angle; pin to pad: 10>shield1 11>shield2; PackageDocument: O; Positions: 9; Published: 15-Jun-2001; LatestRevisionDate: 17-Jul-2002; LatestRevisionNote: Re-released for DXP Platform.; DatasheetDocument: 1-Sep-1999; PackageReference: 788750; Publisher: Altium Limited; Orientation: Right Angle; Gender: Receptacle
-5V T3 T4 T6-T9 T20 = TEST_POINT
ADC_VIN T1 T2 T5 T10-T12 T15-T18 = TEST_POINT2
C1 C16 C19 C39 = CAP: 一般瓷片电容、直插选用RAD0.1，贴片选用0805
C2-C11 C42-C46 = CAP
C12-C15 C24-C27 C35 C37 C41 C50-C57 = CAP: Capacitor
  C25-C27 C35 C37 C41: Published: 8-Jun-2000; Revision: July-2002: Re-released for DXP Platform.; Publisher: Altium Limited; Value: 100nF
C17 C18 C20-C23 = Cap: Capacitor; Published: 8-Jun-2000; LatestRevisionDate: 17-Jul-2002; LatestRevisionNote: Re-released for DXP Platform.; PackageReference: RAD-0.3; Publisher: Altium Limited
  C21: Value: 4.7uF
  C22 C23: Value: 20pF
C28 C29 C36 C38 = ELECTRO1
C30 = Cap Pol1: Polarized Capacitor (Radial); Published: 8-Jun-2000; LatestRevisionDate: 17-Jul-2002; LatestRevisionNote: Re-released for DXP Platform.; PackageReference: RB7.6-15; Publisher: Altium Limited
C40 = Cap Pol2: Polarized Capacitor (Axial); Value: 10uF/6.3V; Published: 8-Jun-2000; LatestRevisionDate: 17-Jul-2002; LatestRevisionNote: Re-released for DXP Platform.; PackageReference: POLAR0.8; Publisher: Altium Limited
D1-D4 D8-D10 = LED
D6 D7 = Diode: Default Diode; Published: 8-Jun-2000; LatestRevisionDate: 17-Jul-2002; LatestRevisionNote: Re-released for DXP Platform.; PackageDocument: Sep-1996; PackageReference: SMC; Publisher: Altium Limited; Code_JEDEC: DO-214-AB
FDET K1-K8 NEG RESET = SW-PB: 乒乓球按键（压下后接通，松开自动断开），较大按键尺寸12mmX12mm选用BUTTON-L封装，较小尺寸6mmX6mm选用BUTTON-S封装
integrator_out = TP
J1 J2 = Header 7X2: Header, 7-Pin, Dual row; LatestRevisionDate: 17-Jul-2002; LatestRevisionNote: Re-released for DXP Platform.; Publisher: Altium Limited
J7-J11 = CON6: 6pin的连接器，一般直插封装选用SIP6（间距2.54mm）
JP1 = JUMPER
P1 = Header 16: Header, 16-Pin; LatestRevisionDate: 17-Jul-2002; LatestRevisionNote: Re-released for DXP Platform.; Publisher: Altium Limited
P2 = Header 18: Header, 18-Pin; LatestRevisionDate: 17-Jul-2002; LatestRevisionNote: Re-released for DXP Platform.; Publisher: Altium Limited
P3 P4 = Header 17: Header, 17-Pin; LatestRevisionDate: 17-Jul-2002; LatestRevisionNote: Re-released for DXP Platform.; Publisher: Altium Limited
P5 P6 P10 P31 = Header 3: Header, 3-Pin; LatestRevisionDate: 17-Jul-2002; LatestRevisionNote: Re-released for DXP Platform.; Publisher: Altium Limited
P7 P16 P25 P26 = Header 2: Header, 2-Pin; LatestRevisionDate: 17-Jul-2002; LatestRevisionNote: Re-released for DXP Platform.; Publisher: Altium Limited
P8 = Header 5X2: Header, 5-Pin, Dual row; LatestRevisionDate: 17-Jul-2002; LatestRevisionNote: Re-released for DXP Platform.; Publisher: Altium Limited
P9 P12 P15 P18 P20 P24 = Header 4X2: Header, 4-Pin, Dual row; LatestRevisionDate: 17-Jul-2002; LatestRevisionNote: Re-released for DXP Platform.; Publisher: Altium Limited
P11 P28 P29 = Header 2X2: Header, 2-Pin, Dual row; LatestRevisionDate: 17-Jul-2002; LatestRevisionNote: Re-released for DXP Platform.; Publisher: Altium Limited
P13 = Header 8: Header, 8-Pin; LatestRevisionDate: 17-Jul-2002; LatestRevisionNote: Re-released for DXP Platform.; Publisher: Altium Limited
P14 = Header 6: Header, 6-Pin; LatestRevisionDate: 17-Jul-2002; LatestRevisionNote: Re-released for DXP Platform.; Publisher: Altium Limited
P17 = LCD_JX-H2154
P19 = Header 8X2: Header, 8-Pin, Dual row; LatestRevisionDate: 17-Jul-2002; LatestRevisionNote: Re-released for DXP Platform.; Publisher: Altium Limited
P21-P23 = 9VPOWE
P27 = Header 4: Header, 4-Pin; LatestRevisionDate: 17-Jul-2002; LatestRevisionNote: Re-released for DXP Platform.; Publisher: Altium Limited
P30 = Header 10X2H: Header, 10-Pin, Dual row, Right Angle; LatestRevisionDate: 17-Jul-2002; LatestRevisionNote: Re-released for DXP Platform.; Publisher: Altium Limited
R1-R4 R23-R26 = RES1: 电阻，1/4w的金属膜直插可选AXIAL0.4封装（长度10mm），贴片可选0805封装，其他电阻可选AXIAL0.5～AXIAL1.0
R5-R9 R20 R27-R31 R35-R37 R40-R47 = RES1
R10-R19 R21 R22 R32 = Res2: Resistor; Published: 8-Jun-2000; LatestRevisionDate: 17-Jul-2002; LatestRevisionNote: Re-released for DXP Platform.; PackageReference: AXIAL-0.4; Publisher: Altium Limited
S2-S4 S8 S9 = SHORT
S5-S7 = SW-SPDT: SPDT Subminiature Toggle Switch, Right Angle Mounting, Vertical Actuation; Published: 24-Mar-1999; LatestRevisionDate: 17-Dec-2003; LatestRevisionNote: Schematic revised, PCB Footprint replaced.; DatasheetDocument: 05-Dec-2000; PackageReference: TL36WW15050; Publisher: Altium Limited; ComponentLink1Description: Manufacturer Link; ComponentLink1URL: http://www.apem.com
U2 = 24CXX
U3-U5 = MAX232: CI-MAX232CPE
U8 = OPA2237
XTAL1 XTAL2 = CRYSTAL